# EAGLE design DAC (EAGLE 7.2.0)
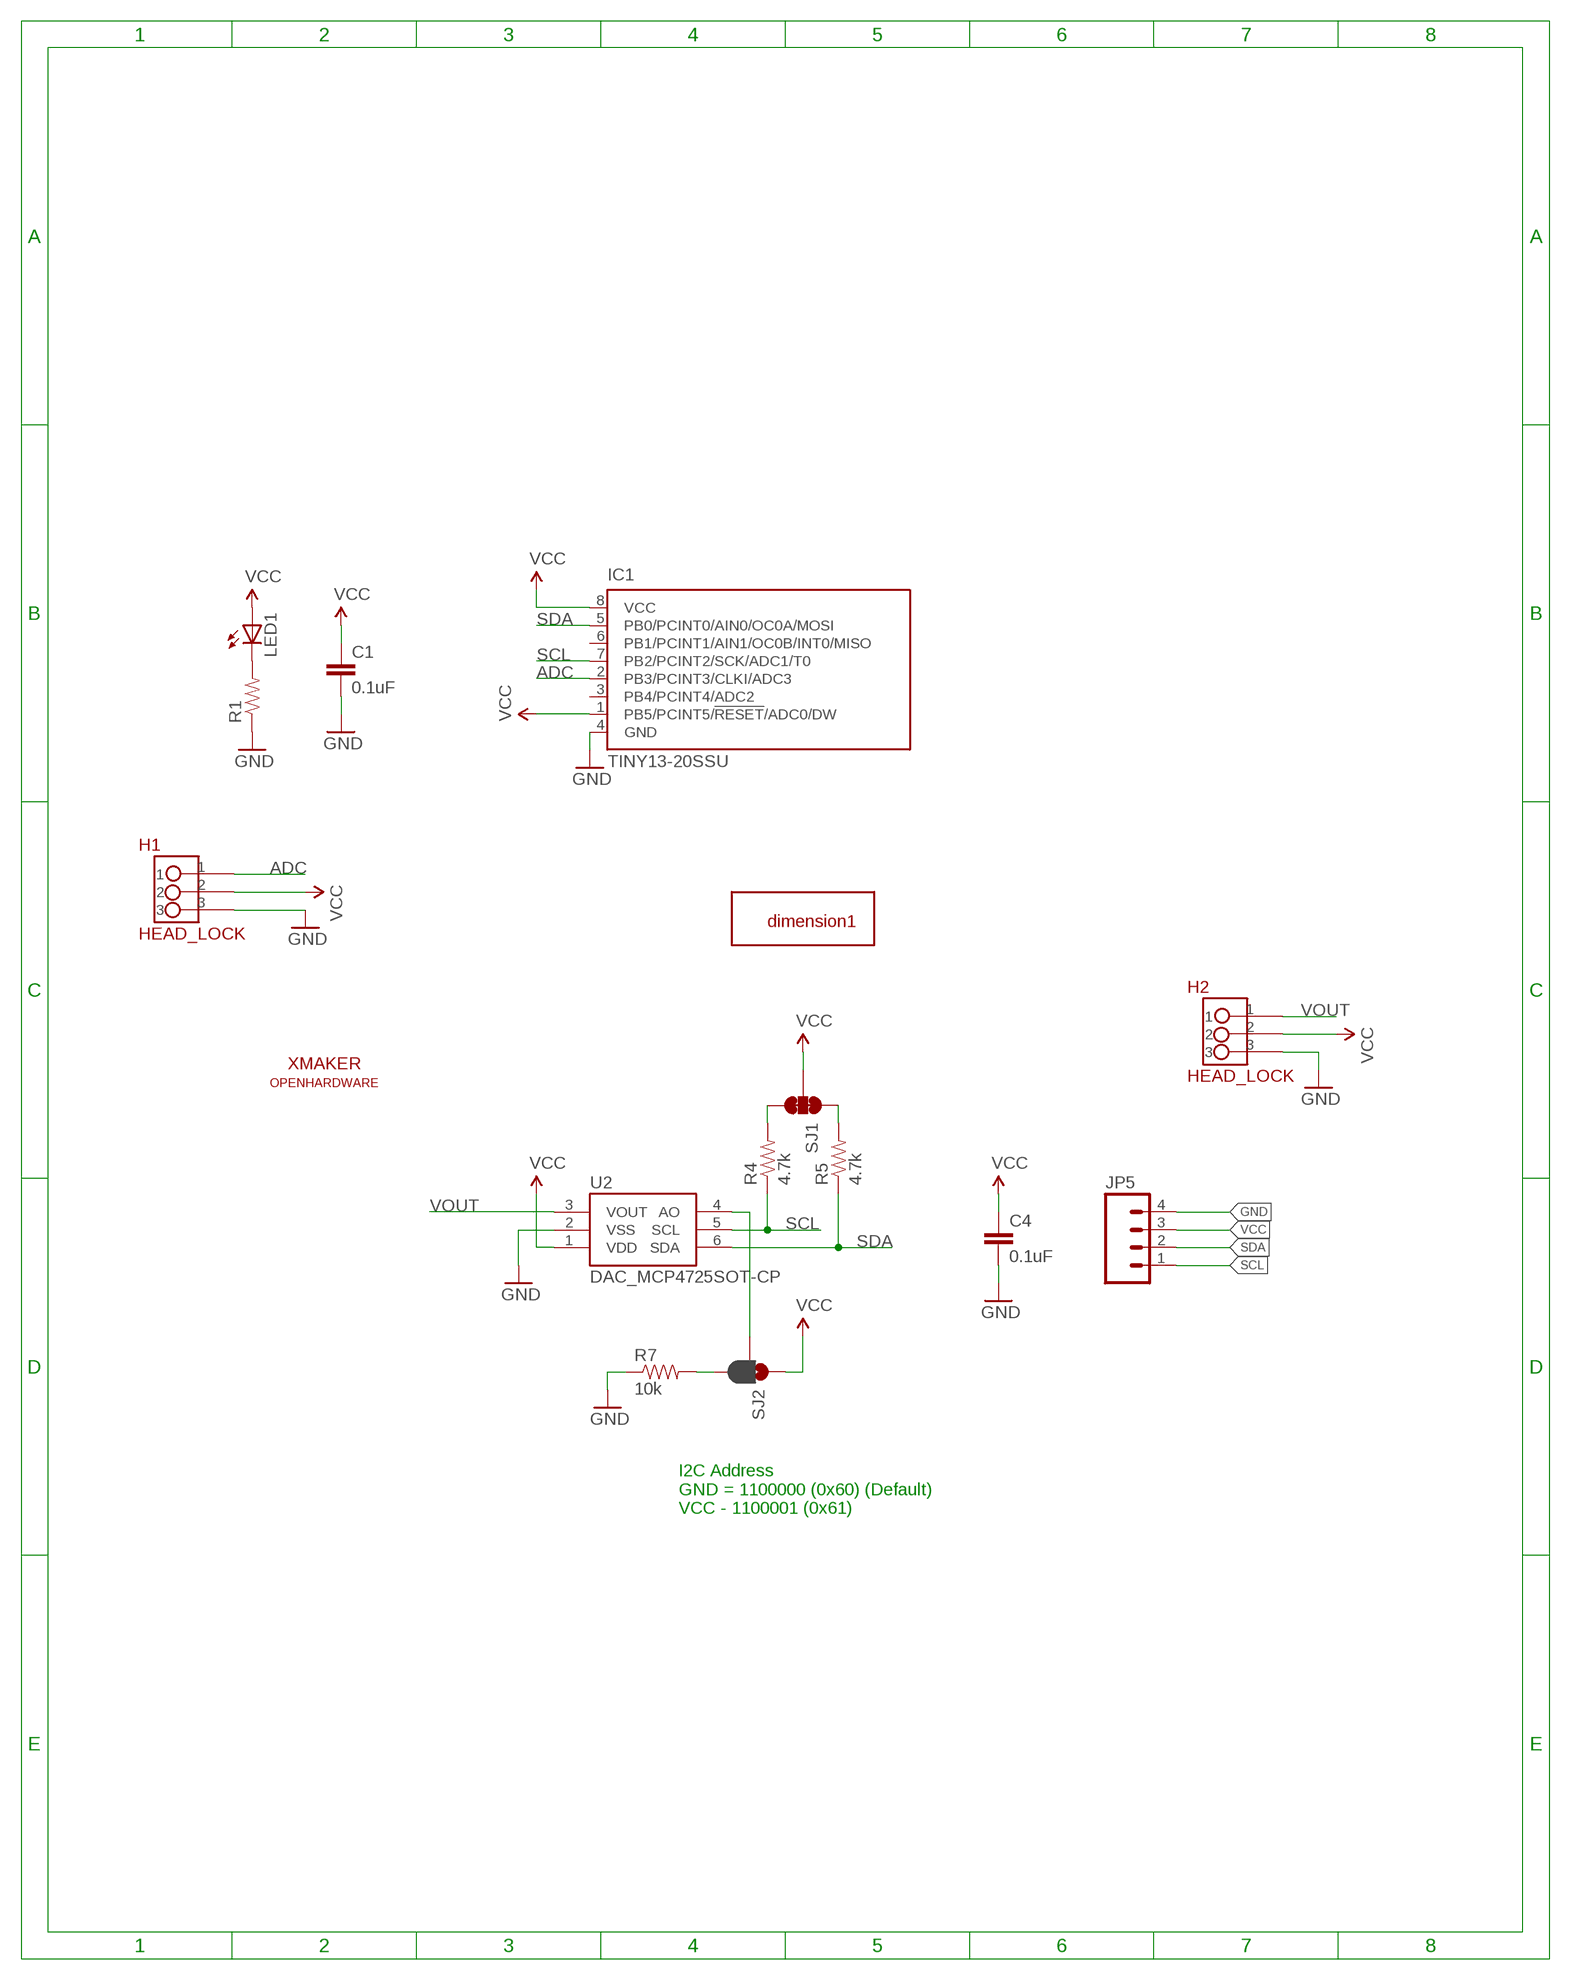
[diagram p0: schematic, sheet 1]

## Parts
C1  0.1uF  CAP0603-CAP  [0603-CAP]
C4  0.1uF  CAP0603-CAP  [0603-CAP]
H1  HEAD_LOCK  [HEAD_LOCK]
H2  HEAD_LOCK  [HEAD_LOCK]
IC1  TINY13-20SSU  [8S1]
JP5  M04PTH  [1X04]
LED1  LEDSML0603  [SML0603]
R1  RESISTOR0603-RES  [0603-RES]
R4  4.7k  RESISTOR0603-RES  [0603-RES]
R5  4.7k  RESISTOR0603-RES  [0603-RES]
R7  10k  RESISTOR0603-RES  [0603-RES]
SJ1  JUMPER-PAD-3-NC_BY_TRACE  [PAD-JUMPER-3-3OF3_NC_BY_TRACE_YES_SILK_FULL_BOX]
SJ2  JUMPER-PAD-3-2OF3_NC_BY_PASTE  [PAD-JUMPER-3-2OF3_NC_BY_PASTE_YES_SILK_FULL_BOX]
U2  DAC_MCP4725SOT-CP  [SOT23-6-MCP4725]
U$1  XMAKERLOGO2  [XMAKERLOGO2]
U$2  DIMENSION1  [DIMENSION1]
U$3  OPENHARDWARE  [OPENHARDWARE]

## Nets
ADC: H1.1 IC1.2(PB3/PCINT3/CLKI/ADC3)
GND [vcc]: C1.2 C4.2 H1.3 H2.3 IC1.4(GND) JP5.4 R1.1 R7.1 U2.2(VSS)
N$1: LED1.C R1.2
N$3: R5.2 SJ1.1
N$4: R4.2 SJ1.3
N$5: SJ2.2 U2.4(AO)
N$6: R7.2 SJ2.3
SCL: IC1.7(PB2/PCINT2/SCK/ADC1/T0) JP5.1 R4.1 U2.5(SCL)
SDA: IC1.5(PB0/PCINT0/AIN0/OC0A/MOSI) JP5.2 R5.1 U2.6(SDA)
VCC: C1.1 C4.1 H1.2 H2.2 IC1.1(PB5/PCINT5/!RESET!/ADC0/DW) IC1.8(VCC) JP5.3 LED1.A SJ1.2 SJ2.1 U2.1(VDD)
VOUT: H2.1 U2.3(VOUT)
Unconnected: IC1.3(PB4/PCINT4/ADC2) IC1.6(PB1/PCINT1/AIN1/OC0B/INT0/MISO)

## Notes on the sheet
- I2C Address
  GND = 1100000 (0x60) (Default)
  VCC - 1100001 (0x61)

## Library data of the parts
C1 C4 = SparkFun:CAP: Capacitor Standard 0603 ceramic capacitor, and 0.1" leaded capacitor.
H1 H2 = HEAD_LOCK:HEAD_LOCK: 带锁的排座
IC1 = atmel:TINY13: 8-bit AVR Microcontroller with 1K Bytes In-System Programmable Flash Source: http://www.atmel.com/dyn/resources/prod_documents/2535S.pdf; MPN: ATTINY13-20SSU; OC_FARNELL: 1455133; OC_NEWARK: 58M3771
JP5 = SparkFun-Connectors:M04: Header 4 Standard 4-pin 0.1" header. Use with straight break away headers (SKU : PRT-00116), right angle break away headers (PRT-00553), swiss pins (PRT-00743), machine pins (PRT-00117), and female headers (PRT-00115). Molex polarized connector foot print use with SKU : PRT-08231 with associated crimp pins and housings. 1MM SMD Version SKU: PRT-10208
LED1 = led:LED: LED OSRAM: - CHIPLED LG R971, LG N971, LY N971, LG Q971, LY Q971, LO R971, LY R971 LH N974, LH R974 LS Q976, LO Q976, LY Q976 LO Q996 - Hyper CHIPLED LW Q18S LB Q993, LB Q99A, LB R99A - SideLED LS A670, LO A670, LY A670, LG A670, LP A670 LB A673, LV A673, LT A673, LW A673 LH A674 LY A675 LS A676, LA A676, LO A676, LY A676, LW A676 LS A679, LY A679, LG A679 - Hyper Micro SIDELED® LS Y876, LA Y876, LO Y876, LY Y876 LT Y87S - SmartLED LW L88C, LW L88S LB L89C, LB L89S, LG L890 LS L89K, LO L89K, LY L89K LS L896, LA L896, LO L896, LY L896 - TOPLED LS T670, LO T670, LY T670, LG T670, LP T670 LSG T670, LSP T670, LSY T670, LOP T670, LYG T670 LG T671, LOG T671, LSG T671 LB T673, LV T673, LT T673, LW T673 LH T674 LS T676, LA T676, LO T676, LY T676, LB T676, LH T676, LSB T676, LW T676 LB T67C, LV T67C, LT T67C, LS T67K, LO T67K, LY T67K, LW E67C LS E67B, LA E67B, LO E67B, LY E67B, LB E67C, LV E67C, LT E67C LW T67C LS T679, LY T679, LG T679 LS T770, LO T770, LY T770, LG T770, LP T770 LB T773, LV T773, LT T773, LW T773 LH T774 LS E675, LA E675, LY E675, LS T675 LS T776, LA T776, LO T776, LY T776, LB T776 LHGB T686 LT T68C, LB T68C - Hyper Mini TOPLED® LB M676 - Mini TOPLED Santana® LG M470 LS M47K, LO M47K, LY M47K Source: http://www.osram.convergy.de LUXEON: - LUMILED® LXK2-PW12-R00, LXK2-PW12-S00, LXK2-PW14-U00, LXK2-PW14-V00 LXK2-PM12-R00, LXK2-PM12-S00, LXK2-PM14-U00 LXK2-PE12-Q00, LXK2-PE12-R00, LXK2-PE12-S00, LXK2-PE14-T00, LXK2-PE14-U00 LXK2-PB12-K00, LXK2-PB12-L00, LXK2-PB12-M00, LXK2-PB14-N00, LXK2-PB14-P00, LXK2-PB14-Q00 LXK2-PR12-L00, LXK2-PR12-M00, LXK2-PR14-Q00, LXK2-PR14-R00 LXK2-PD12-Q00, LXK2-PD12-R00, LXK2-PD12-S00 LXK2-PH12-R00, LXK2-PH12-S00 LXK2-PL12-P00, LXK2-PL12-Q00, LXK2-PL12-R00 Source: www.luxeon.com KINGBRIGHT: KA-3528ASYC Source: www.kingbright.com
R1 = SparkFun-Passives:RESISTOR: Resistor Basic schematic elements and footprints for 0603, 1206, and PTH resistors.
R4 R5 R7 = SparkFun:RESISTOR: Resistor Basic schematic elements and footprints for 0603, 1206, and PTH resistors.
SJ1 = SparkFun-Passives:JUMPER-PAD-3-NC_BY_TRACE
SJ2 = SparkFun-Passives:JUMPER-PAD-3-2OF3_NC_BY_PASTE
U2 = SparkFun-AnalogIC:DAC_MCP4725: Microchip 12-bit I2C DAC, SOT23-6
U$1 = Xmaker_yuhui:XMAKERLOGO2
U$2 = Xmaker_yuhui:DIMENSION1
U$3 = Xmaker_yuhui:OPENHARDWARE

## Net classes
1 vcc: width 0.254 mm

## Board
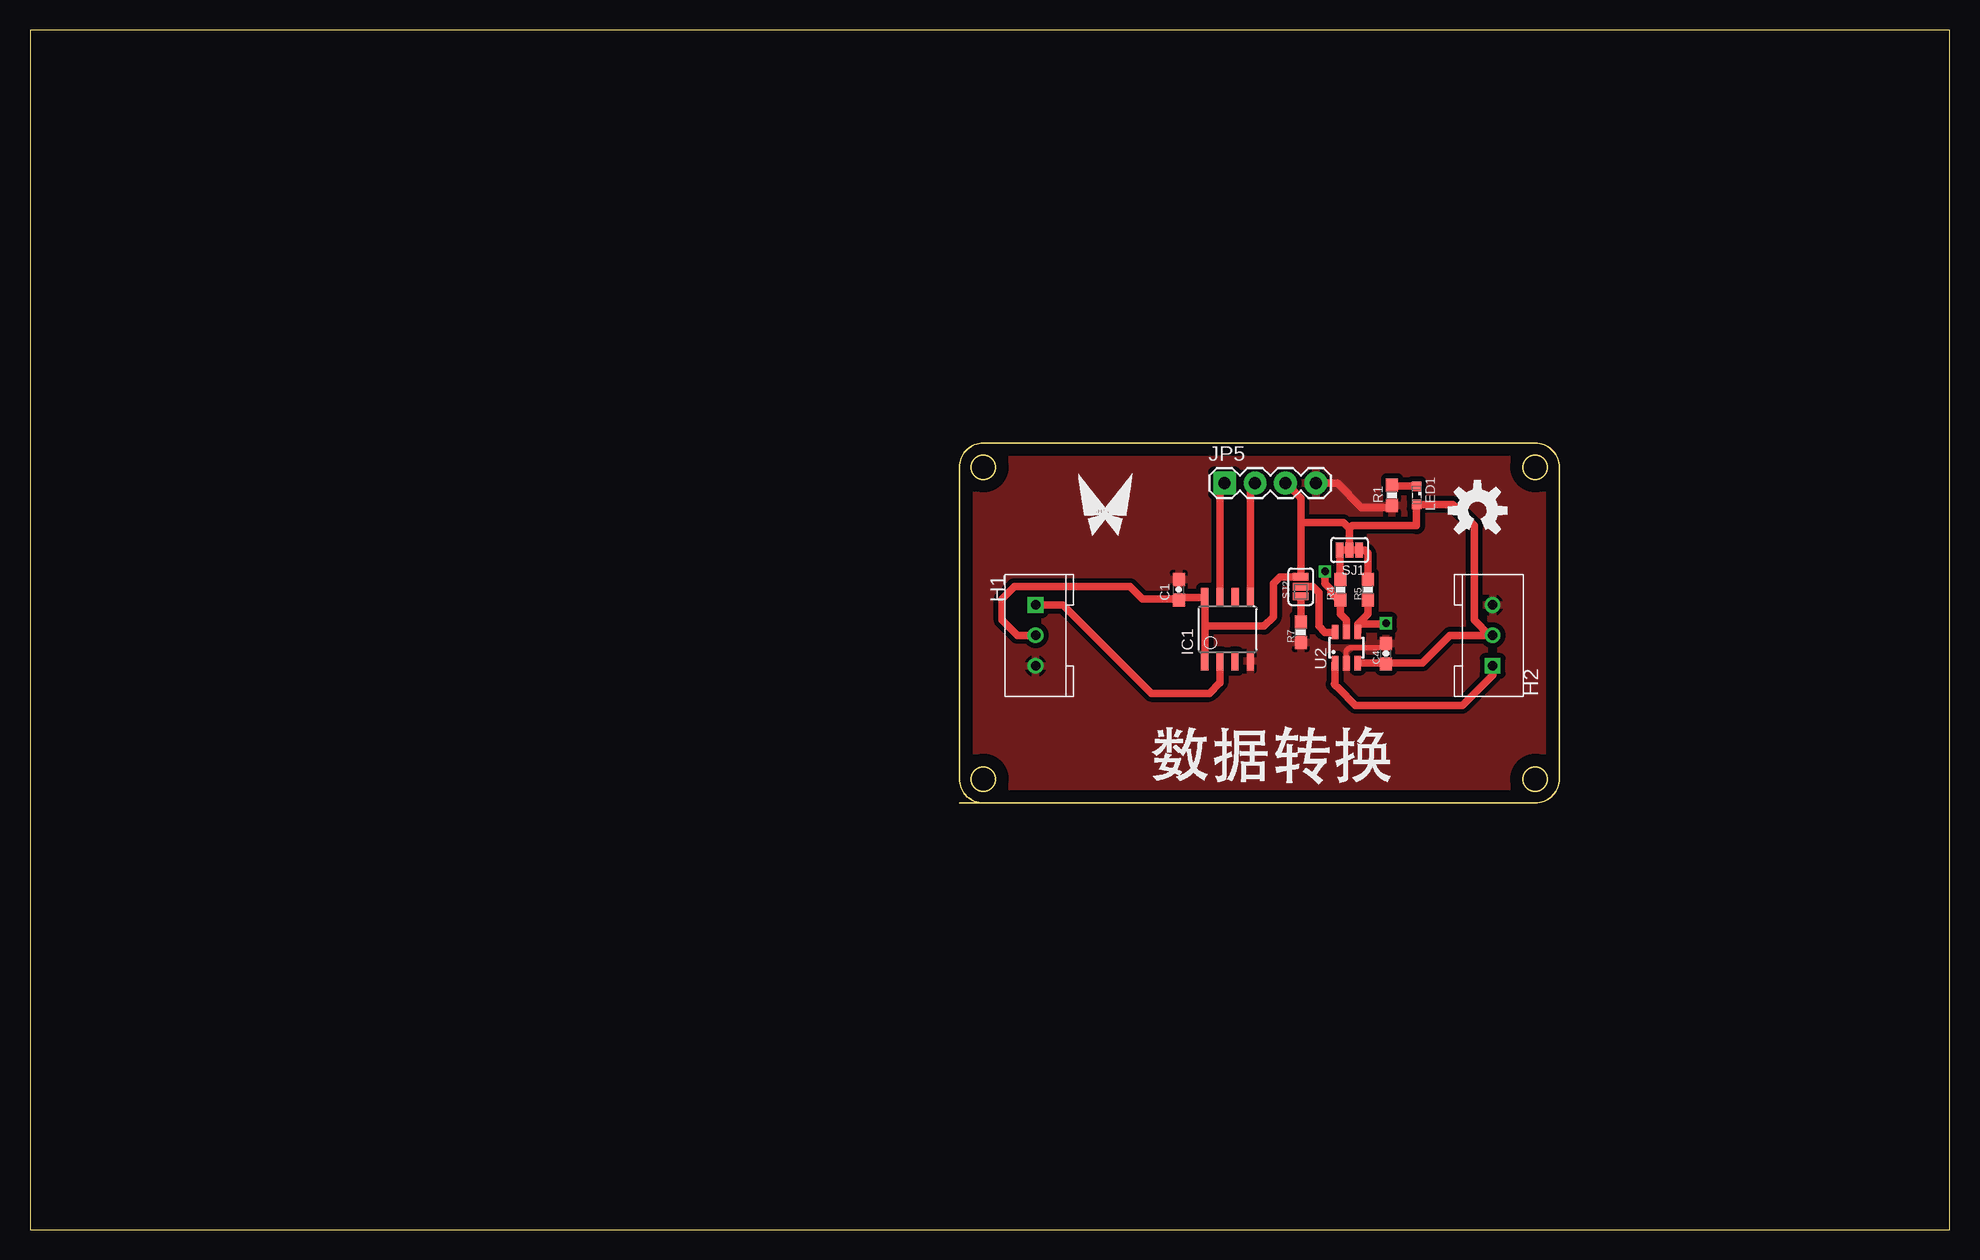
[diagram p1: board, top side]
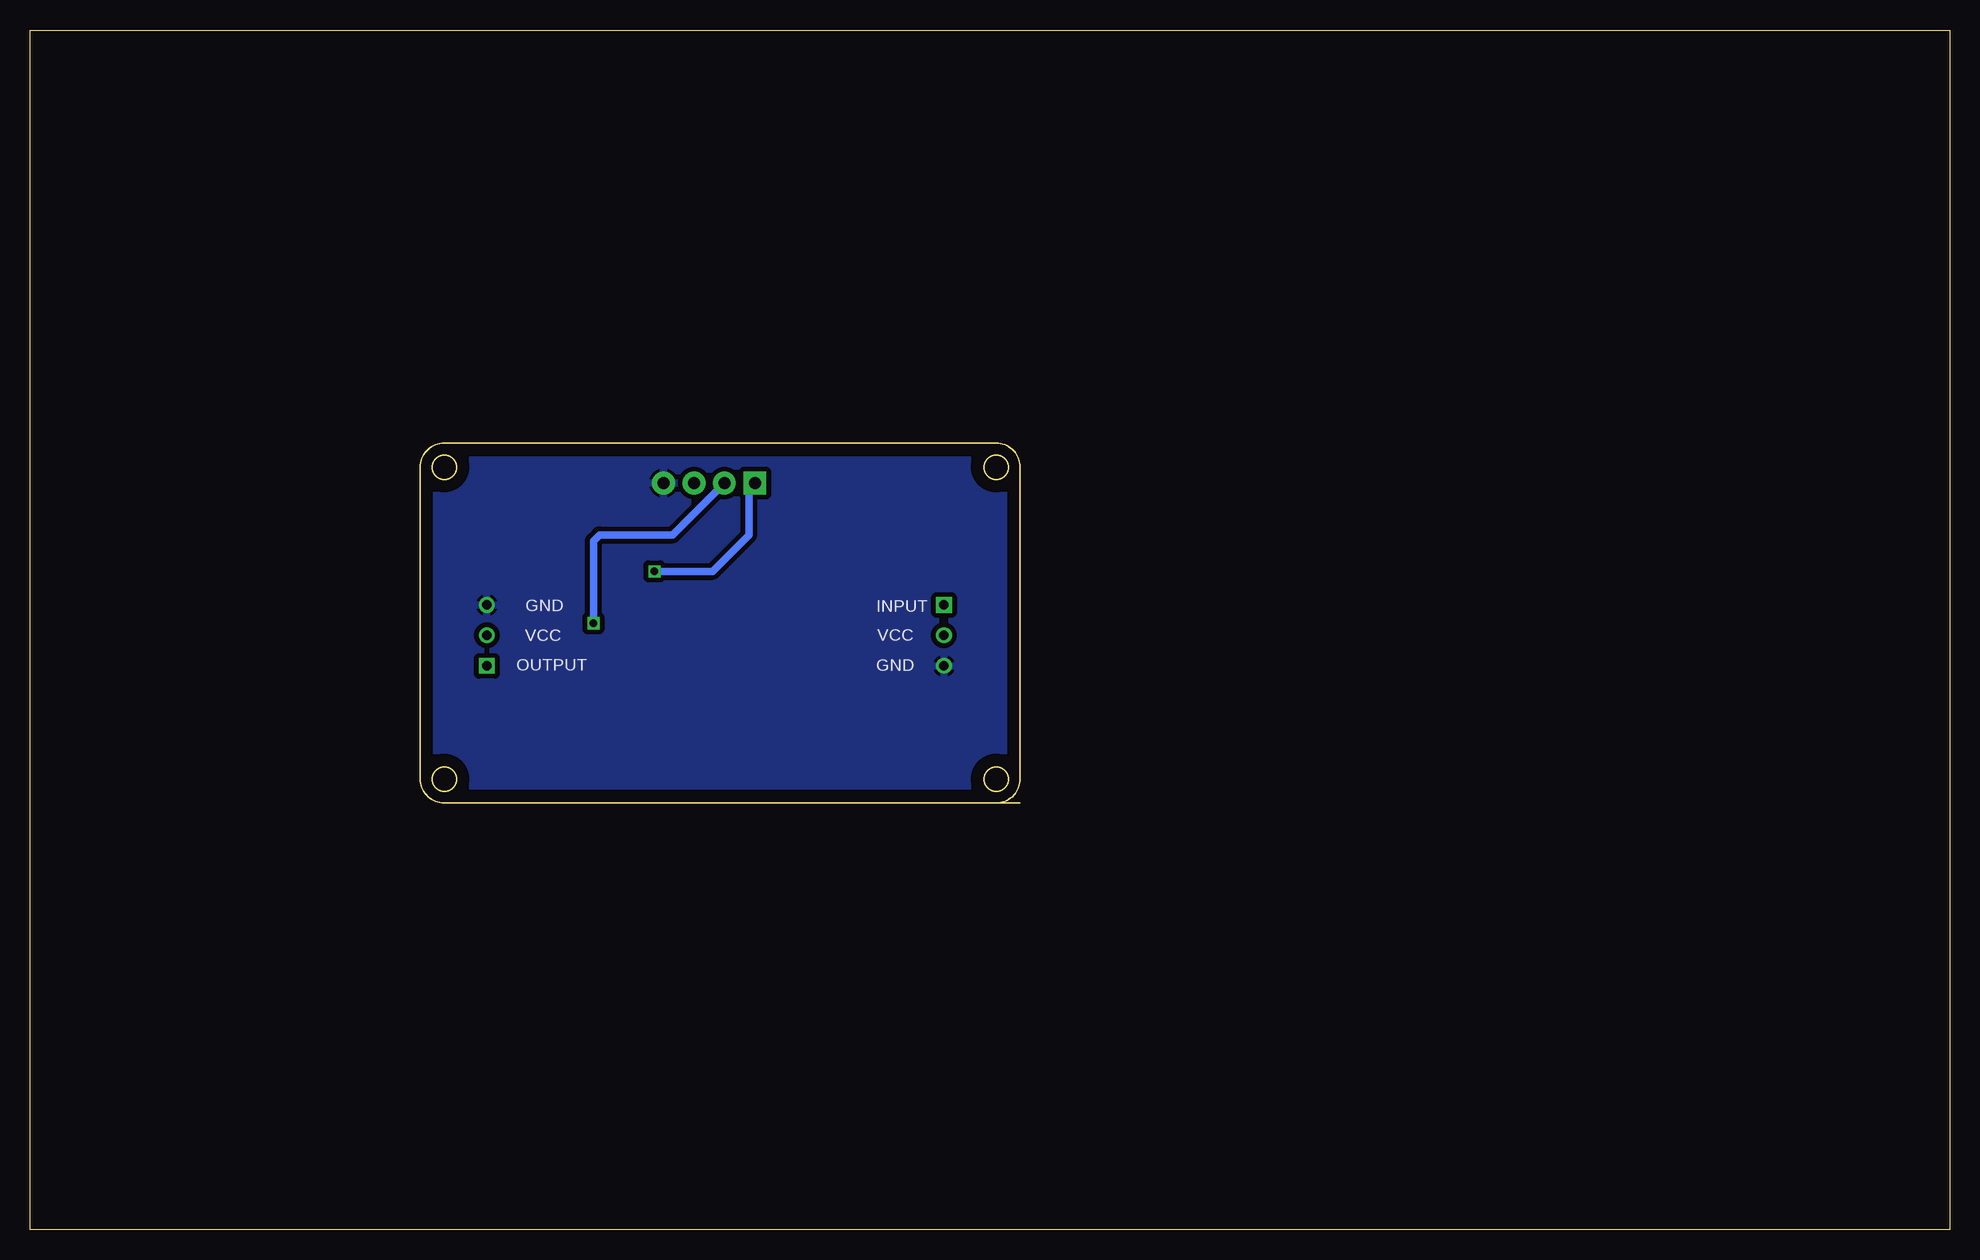
[diagram p2: board, bottom side, seen from below]

Size 160 x 100 mm. Coordinates in mm from the lower left corner, seen from the top.
Outline: 0,0 160,0 160,100 0,100 0,0
Copper layers (1*16): Top 0.035mm / dielectric 1.5mm / Bottom 0.035mm
Design rules "default": minimum track width 10mil, minimum drill 24mil, track to track 8mil, track to pad 8mil, pad to pad 8mil, via to via 8mil, smd to smd 8mil, copper to edge 40mil, drill to drill 8mil, minimum pad ring 10mil, minimum via ring 8mil, stop-mask expansion 4mil, vias tented up to drill 0mil, thermal gap 10mil

### Footprints (pad centres in the part's own frame; a part is rotated, then mirrored left to right if it is on the bottom)
0603-CAP = smd 1.1 x 1: 1 -0.85,0; 2 0.85,0
HEAD_LOCK = drill 0.8 square: 1 0,0 | drill 0.8: 2 2.54,0; 3 5.08,0
8S1 = smd 0.6 x 1.6: 1 -1.905,-2.654; 2 -0.645,-2.654; 3 0.625,-2.654; 4 1.895,-2.654; 5 1.905,2.654; 6 0.635,2.654; 7 -0.635,2.654; 8 -1.905,2.654
1X04 = drill 1.016 pad 1.88 square: 1 0,0 | drill 1.016 pad 1.88: 2 2.54,0; 3 5.08,0; 4 7.62,0
SML0603 = smd 0.8 x 0.8: A 0.75,0; C -0.75,0
0603-RES = smd 1.1 x 1: 1 -0.85,0; 2 0.85,0
PAD-JUMPER-3-3OF3_NC_BY_TRACE_YES_SILK_FULL_BOX = smd 0.635 x 1.27: 1 -0.813,0; 2 0,0; 3 0.813,0
PAD-JUMPER-3-2OF3_NC_BY_PASTE_YES_SILK_FULL_BOX = smd 0.635 x 1.27: 1 -0.813,0; 2 0,0; 3 0.813,0
SOT23-6-MCP4725 = smd 0.55 x 1.2: 1 0.95,-1.3; 2 0,-1.3; 3 -0.95,-1.3; 4 -0.95,1.3; 5 0,1.3; 6 0.95,1.3

### Placement (x,y rotation side)
C1  95.76,53.34 90 top
C4  113.03,48.01 90 top
H1  83.82,52.07 270 top
H2  121.92,46.99 90 top
IC1  99.82,50.04 0 top
JP5  99.57,62.23 0 top
LED1  115.57,61.21 270 top
R1  113.54,61.21 90 top
R4  109.22,53.34 90 top
R5  111.51,53.34 90 top
R7  105.92,49.78 90 top
SJ1  109.98,56.64 180 top
SJ2  105.92,53.59 270 top
U2  109.73,48.51 0 top
U$1  86.11,56.9 0 top
U$2  77.47,35.56 0 top
U$3  120.65,59.94 0 top

### Tracks (layer width: path | path; a pad name or v marks a point on that pad's centre or on a via)
ADC
  Top 0.61: H1.1 86.11,52.07 93.47,44.7 98.3,44.7 98.42,44.83 99.06,45.47 99.18,45.58 IC1.2
GND
  Top 0.406: U2.2 109.73,48.26 109.98,48.51 112.69,48.51 C4.2
  Top 0.61: JP5.4 108.97,62.23 111,60.2 113.37,60.2 R1.1
  pour Bottom (isolate 0.406): 74.68,70.36 130.05,70.36 130.05,32.26 74.68,32.26
  pour Top (isolate 0.406): 74.68,70.36 130.05,70.36 130.05,32.26 74.68,32.26
N$1
  Top 0.61: LED1.C 113.64,61.96 R1.2
N$3
  Top 0.61: SJ1.1 111.25,56.64 111.51,56.39 R5.2
N$4
  Top 0.61: R4.2 109.17,54.24 SJ1.3 110.74,56.64
N$5
  Top 0.61: SJ2.2 106.93,53.59 107.44,53.09 107.44,50.29 107.95,49.78 108.75,49.78 U2.4
N$6
  Top 0.61: R7.2 SJ2.3
SCL  (via drill 0.61)
  Top 0.61: U2.5 109.73,50.8 109.22,51.31 R4.1 109.05,52.49 108.46,53.09 108.46,53.34 107.95,53.85 v107.95,54.86 | IC1.7 99.19,61.85 JP5.1
  Bottom 0.61: v107.95,54.86 103.12,54.86 100.08,57.91 100.08,61.72 JP5.1
SDA  (via drill 0.61)
  Top 0.61: U2.6 110.68,50.48 | 110.68,50.48 111.51,51.31 R5.1 | IC1.5 101.73,61.85 JP5.2 | 110.68,50.48 112.96,50.48 v113.03,50.55
  Bottom 0.61: 102.36,61.98 JP5.2 106.43,57.91 112.52,57.91 113.03,57.4 v113.03,50.55
VCC
  Top 0.61: U2.1 112.97,47.21 C4.1 113.12,47.24 116.08,47.24 118.36,49.53 H2.2 121.67,49.53 120.4,50.8 120.4,58.67 118.62,60.45 115.58,60.45 LED1.A 115.57,58.67 110.24,58.67 109.98,58.42 | 97.92,50.29 IC1.8 95.96,52.69 C1.1 95.67,52.58 92.71,52.58 91.69,53.59 82.04,53.59 81.03,52.58 81.03,50.8 82.3,49.53 H1.2 | 97.92,50.29 IC1.1 | 105.92,58.93 SJ2.1 104.19,54.41 103.63,53.85 103.63,51.05 102.87,50.29 97.92,50.29 | 105.92,58.93 105.92,60.96 JP5.3 | SJ1.2 109.98,58.42 | 105.92,58.93 109.47,58.93 109.98,58.42
VOUT
  Top 0.61: H2.1 121.92,46.23 119.38,43.69 110.49,43.69 109.09,45.09 108.78,45.4 | 108.78,45.4 108.71,45.47 | U2.3 108.78,45.4

### Text on the board
tPlace: C:/Users/Xiangzi/Desktop/Ãû³Æ/Êý¾Ý×ª»».bmp
bPlace: GND | INPUT | VCC | VCC | OUTPUT | GND